# EAGLE schematic full computer (EAGLE 9.6.2)
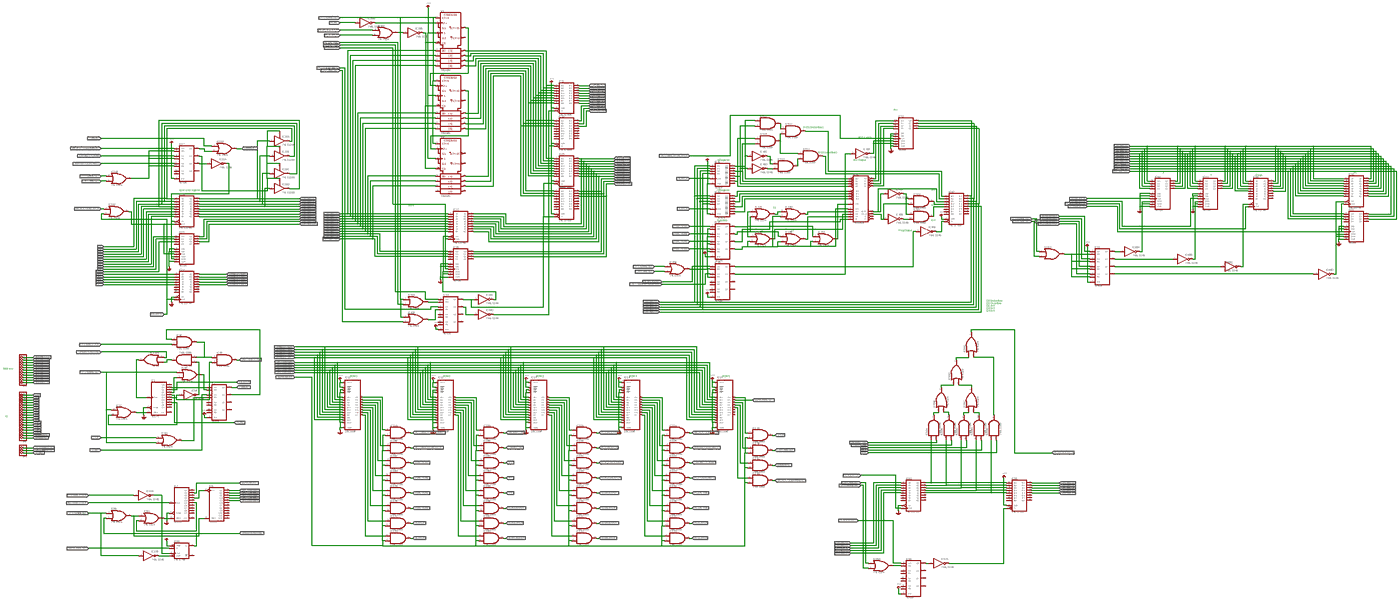
[diagram p0: schematic, sheet 1, overview]
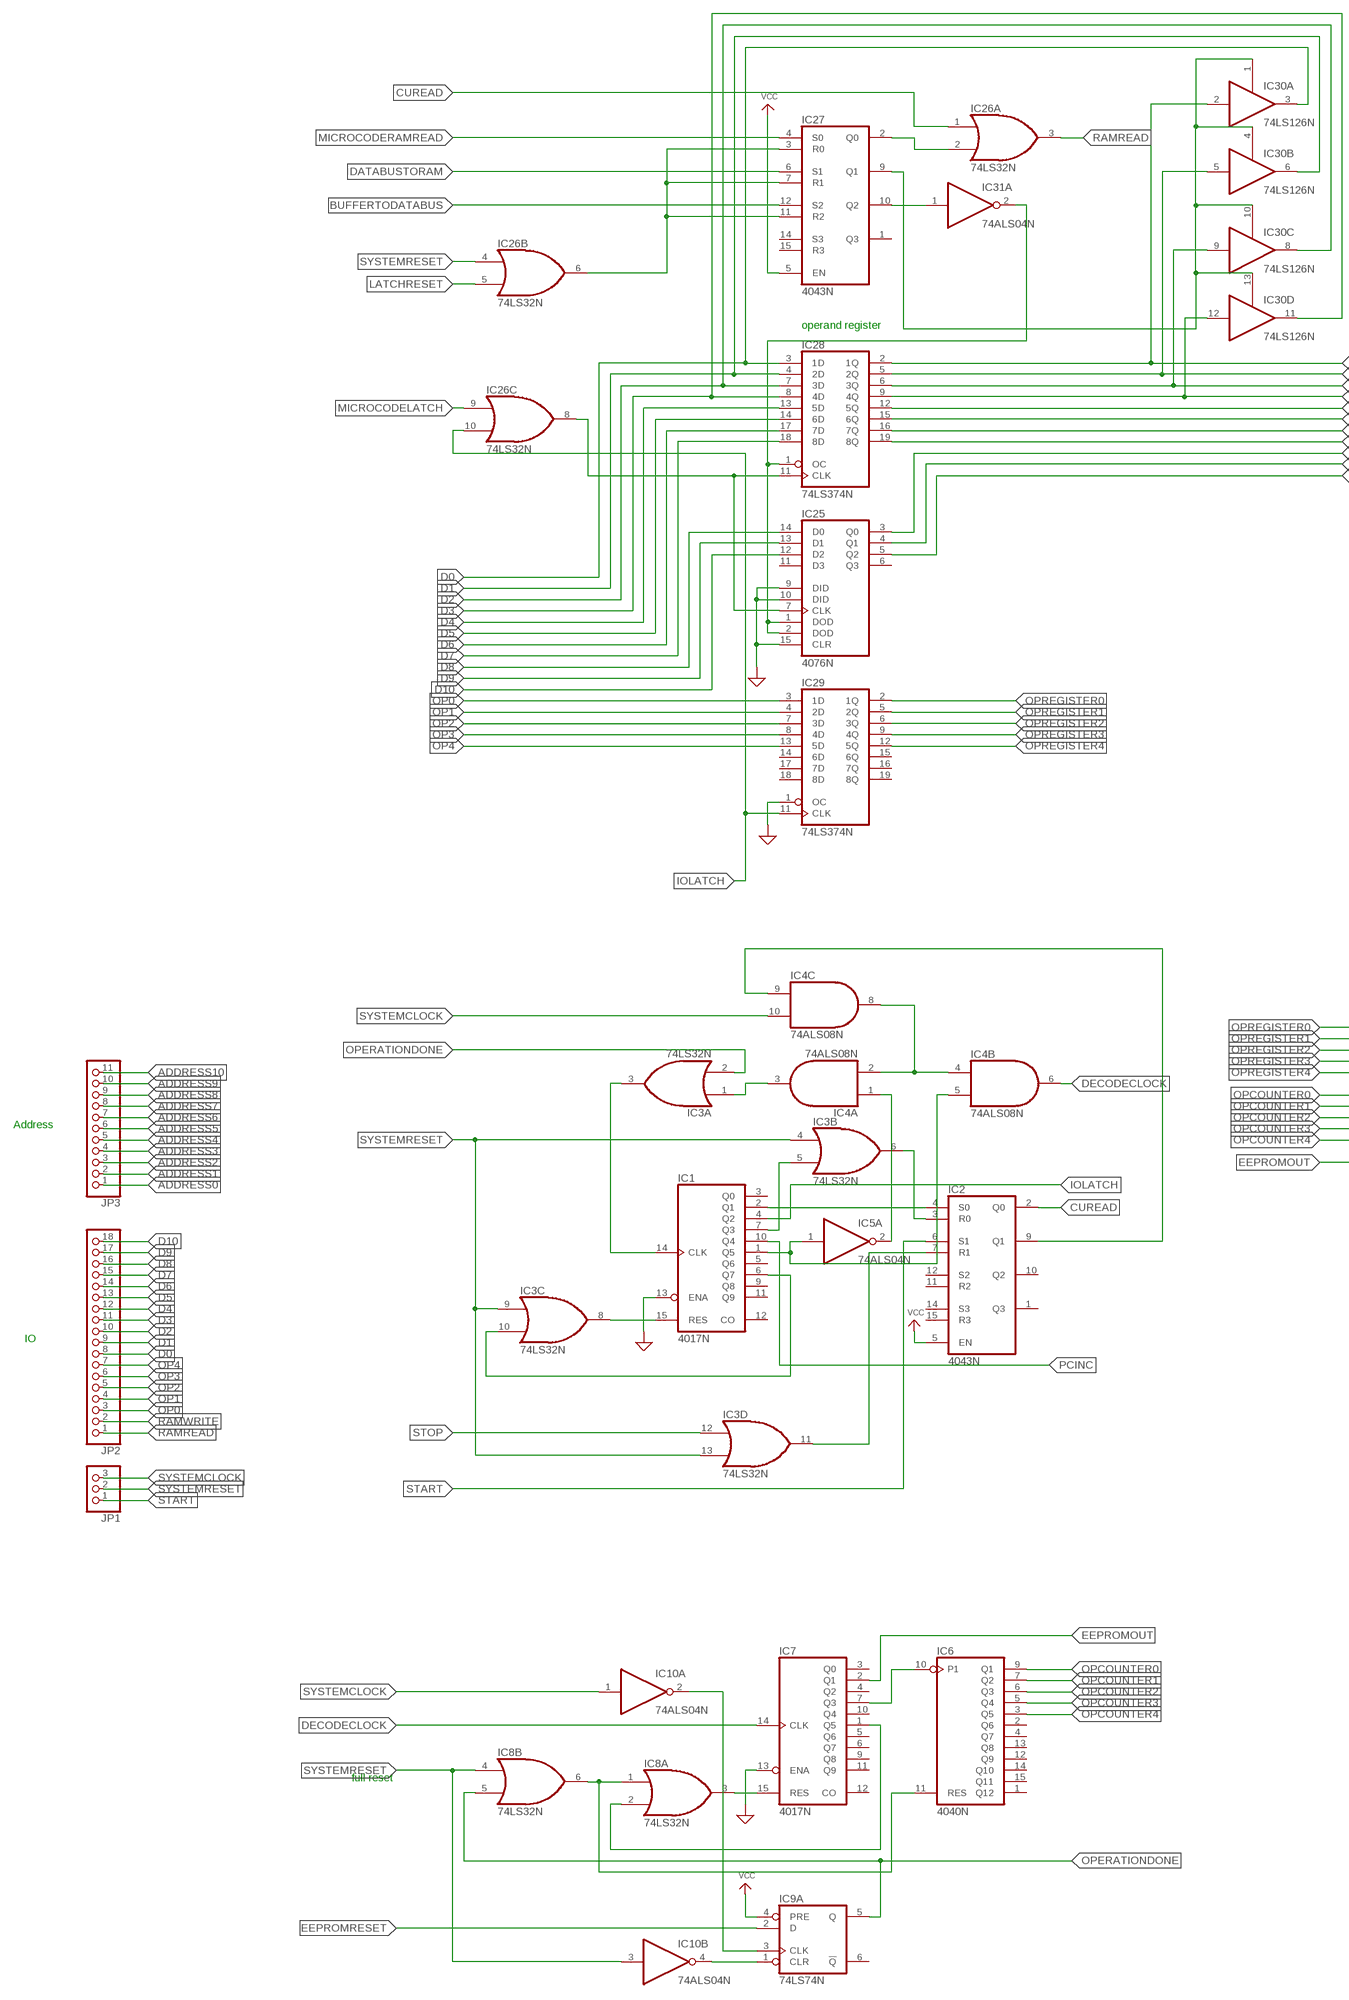
[diagram p1: schematic, sheet 1, part 1 of 6]
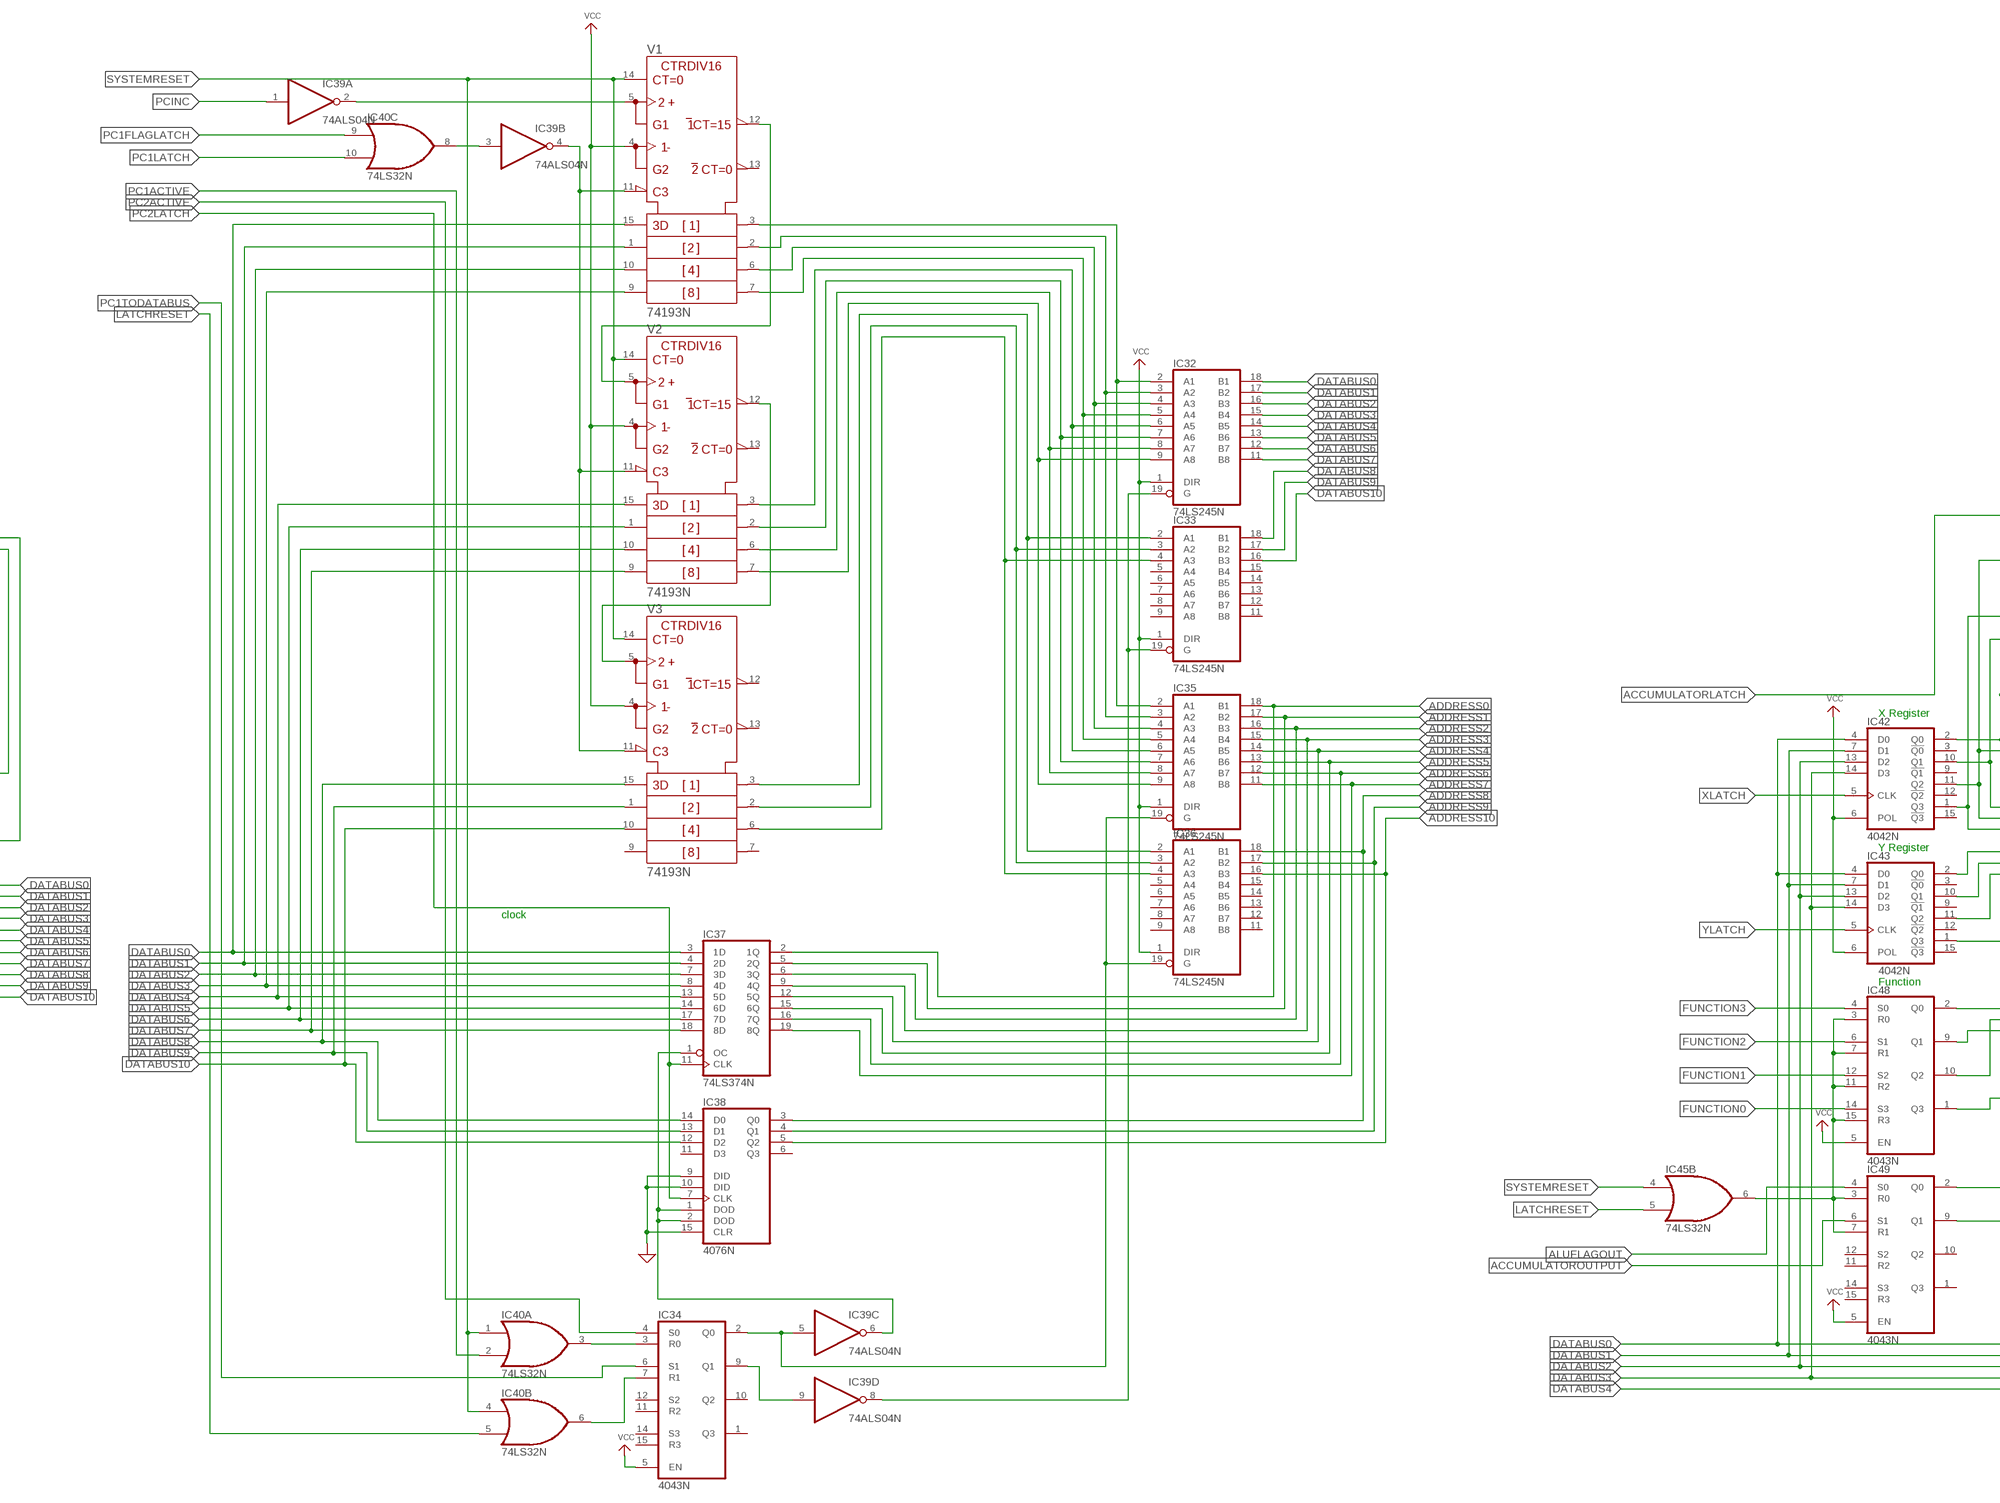
[diagram p2: schematic, sheet 1, part 2 of 6]
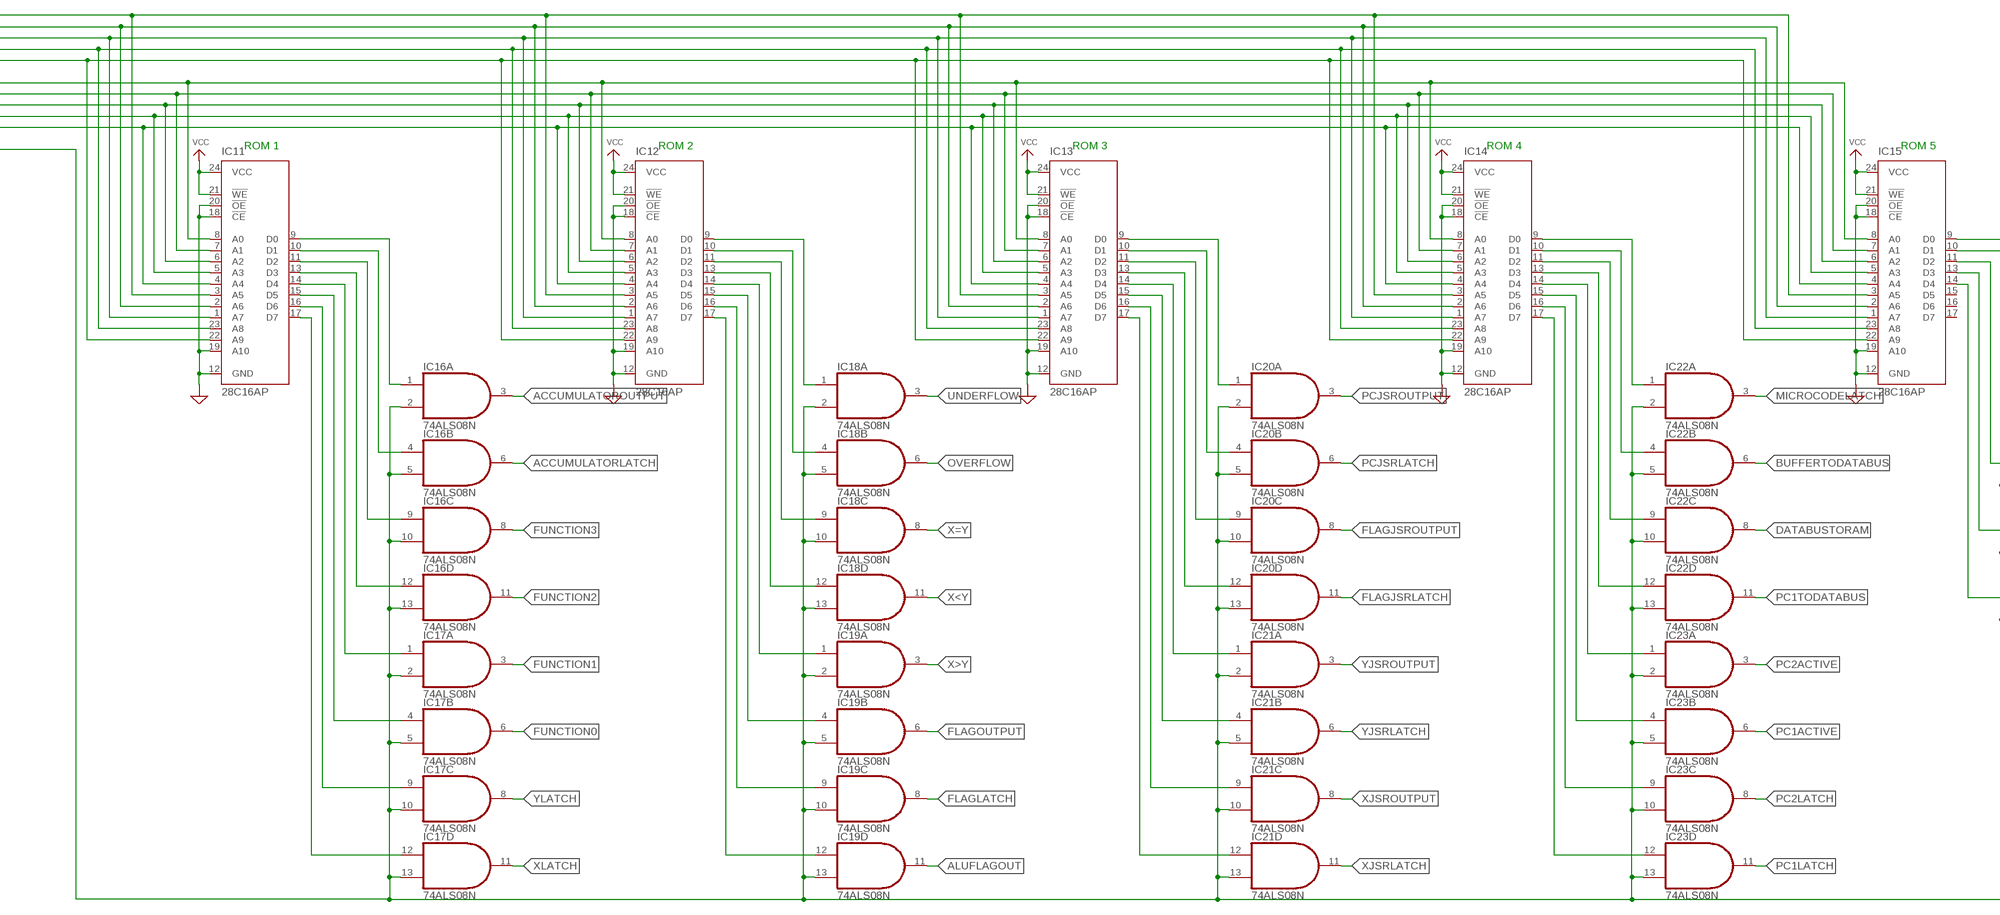
[diagram p3: schematic, sheet 1, part 3 of 6]
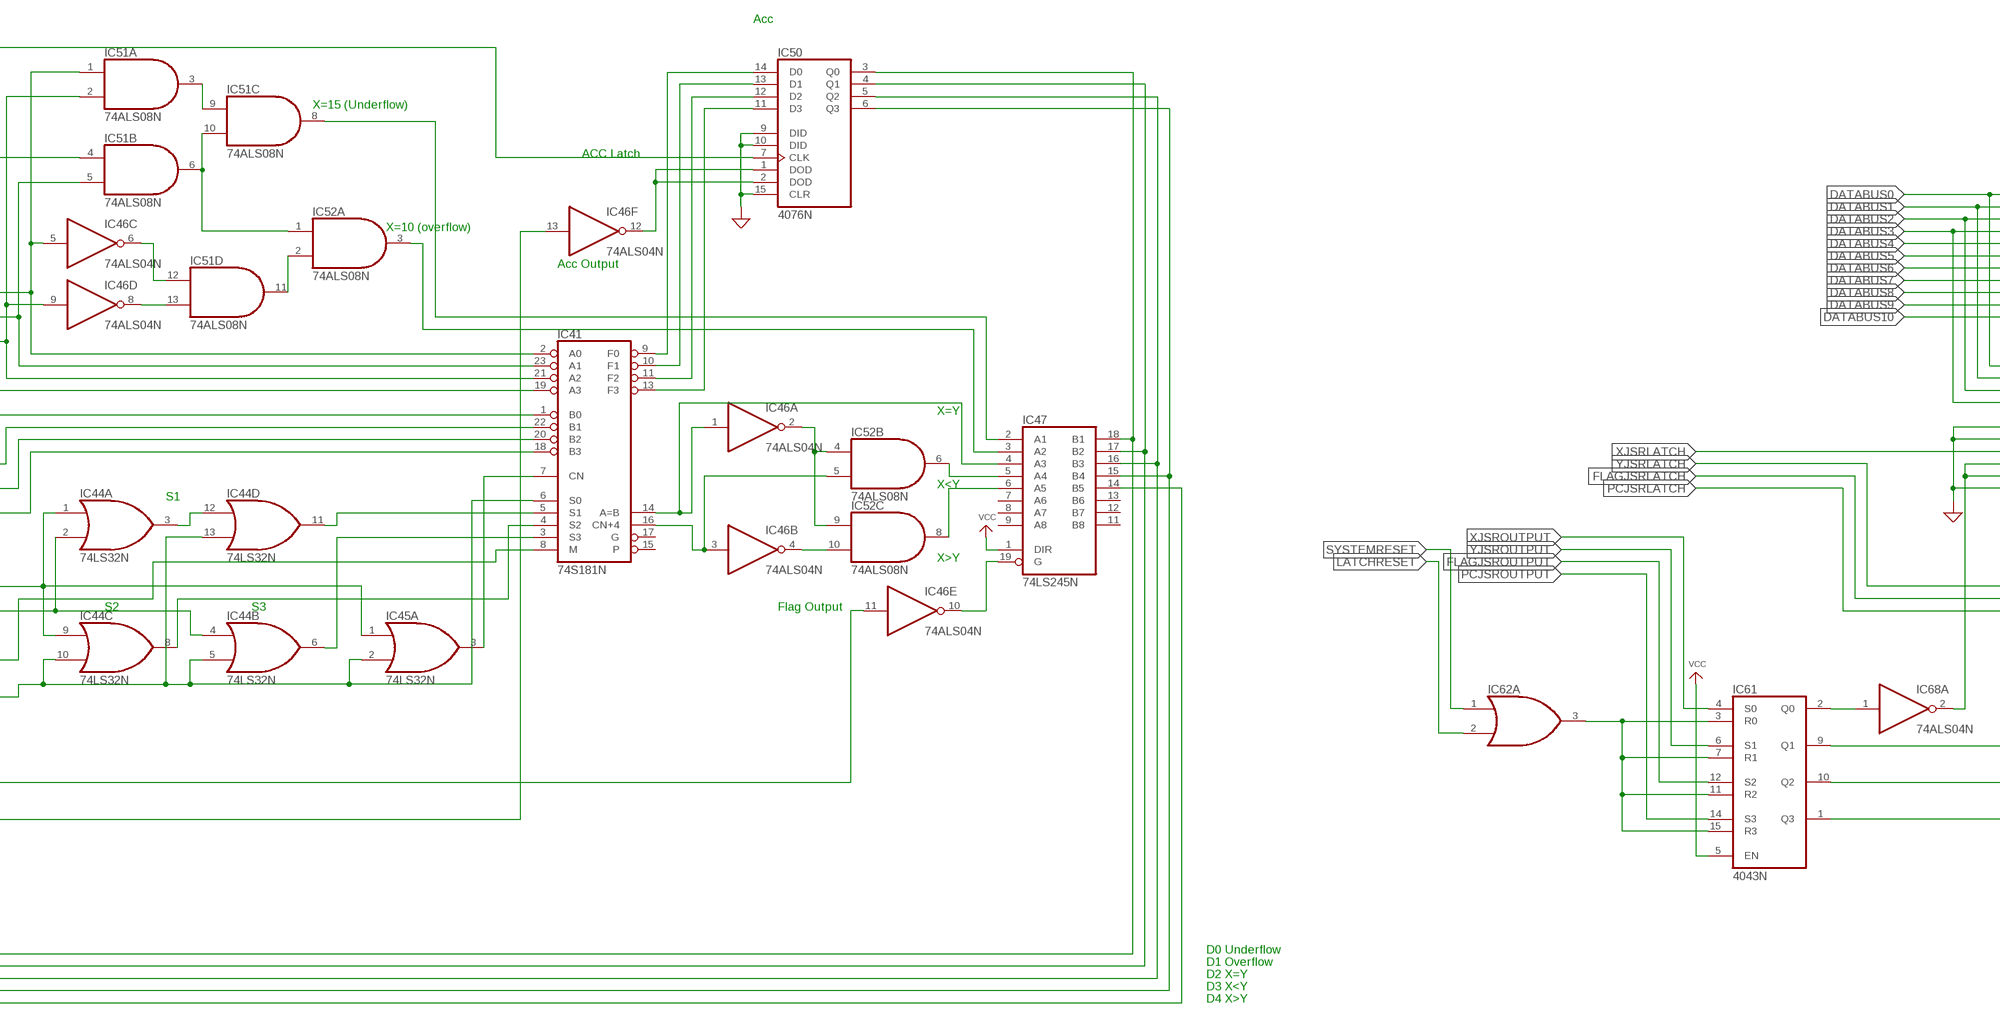
[diagram p4: schematic, sheet 1, part 4 of 6]
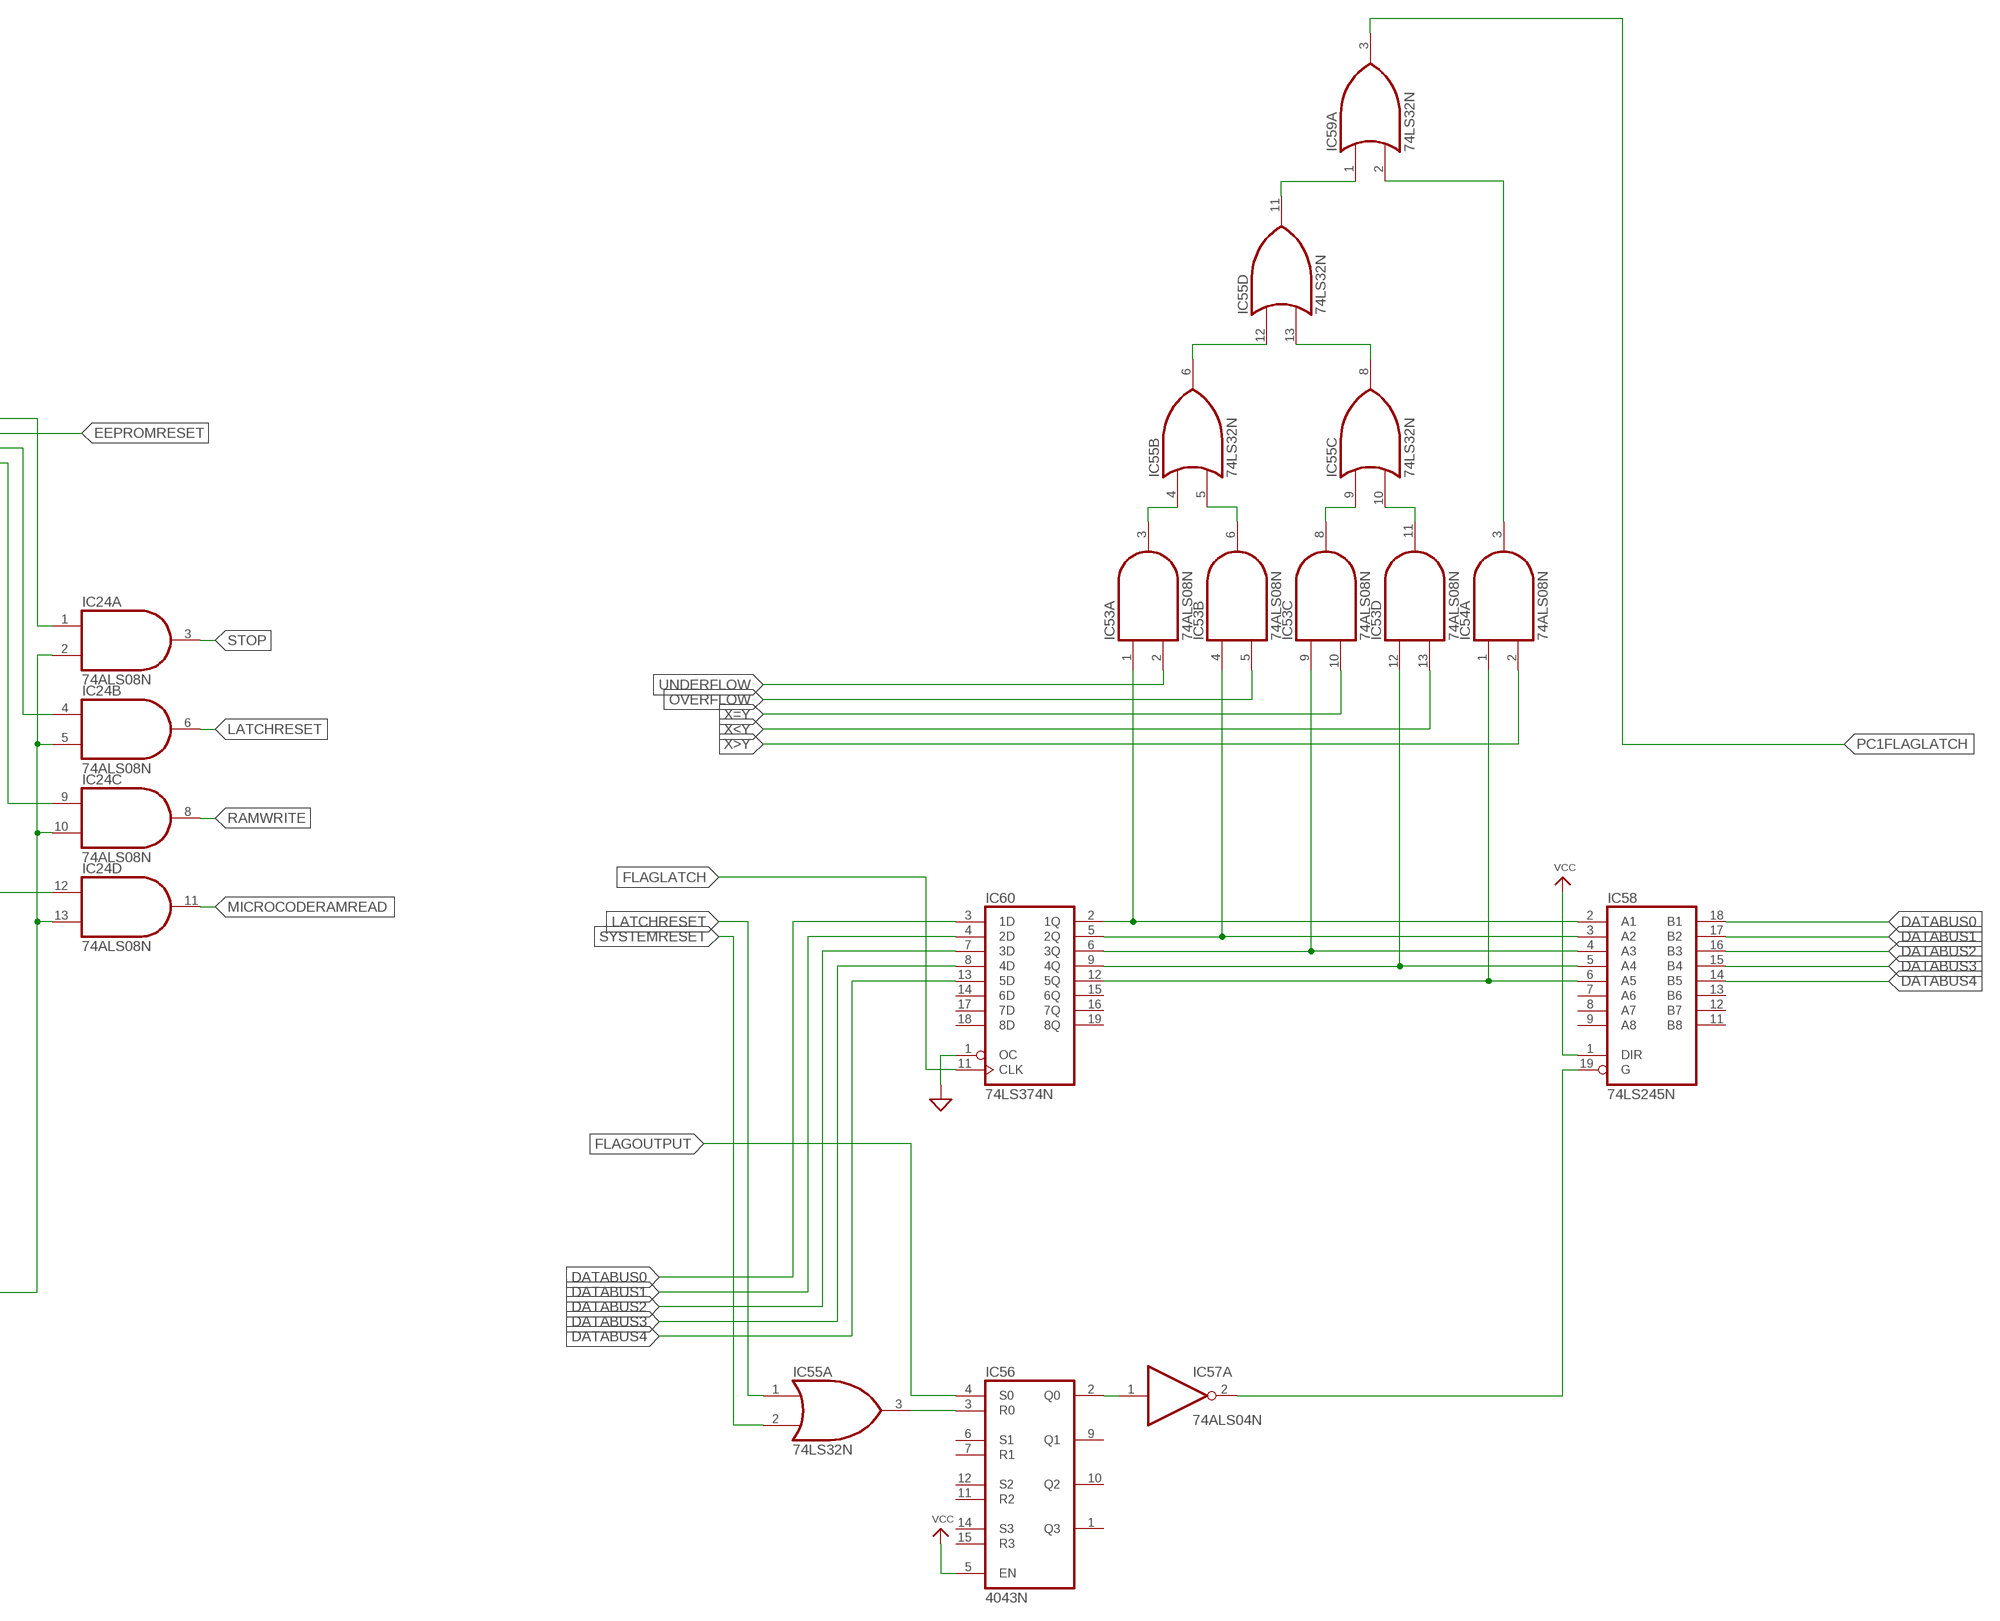
[diagram p5: schematic, sheet 1, part 5 of 6]
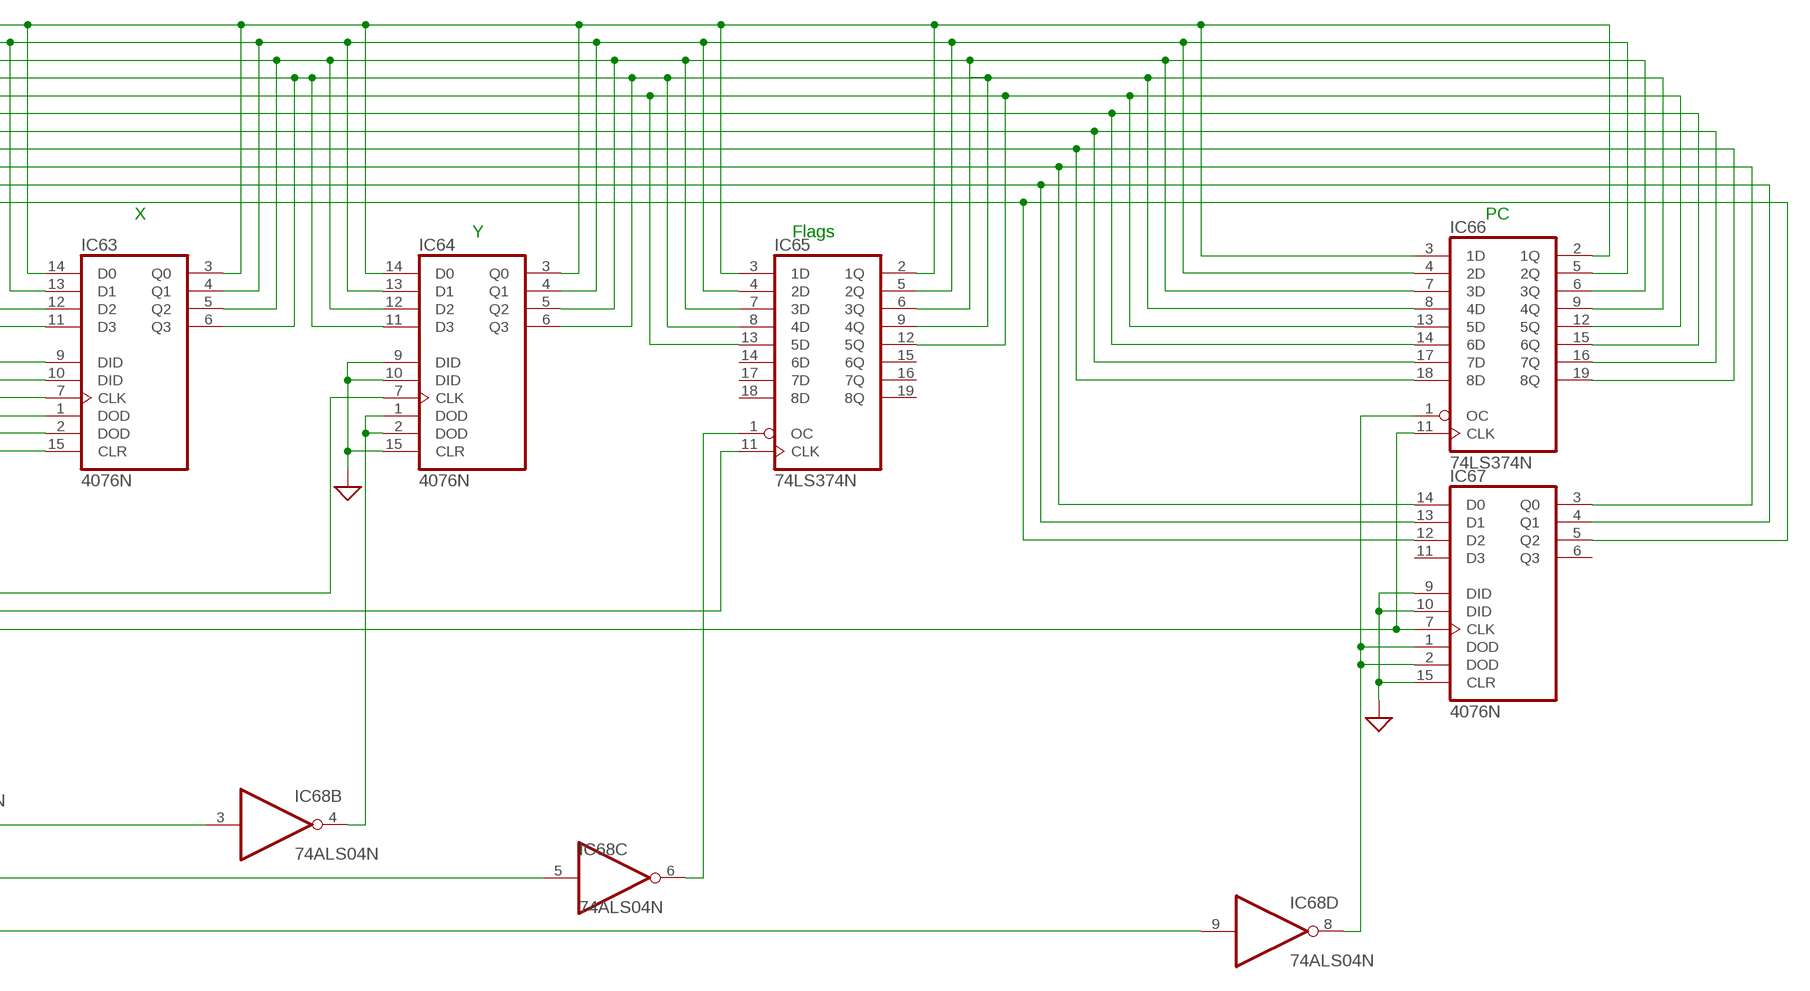
[diagram p6: schematic, sheet 1, part 6 of 6]

## Parts
IC1  4017N  [DIL16]
IC2  4043N  [DIL16]
IC3  74LS32N  [DIL14]
IC4  74ALS08N  [DIL14]
IC5  74ALS04N  [DIL14]
IC6  4040N  [DIL16]
IC7  4017N  [DIL16]
IC8  74LS32N  [DIL14]
IC9  74LS74N  [DIL14]
IC10  74ALS04N  [DIL14]
IC11  28C16AP  [DIL24-6]
IC12  28C16AP  [DIL24-6]
IC13  28C16AP  [DIL24-6]
IC14  28C16AP  [DIL24-6]
IC15  28C16AP  [DIL24-6]
IC16  74ALS08N  [DIL14]
IC17  74ALS08N  [DIL14]
IC18  74ALS08N  [DIL14]
IC19  74ALS08N  [DIL14]
IC20  74ALS08N  [DIL14]
IC21  74ALS08N  [DIL14]
IC22  74ALS08N  [DIL14]
IC23  74ALS08N  [DIL14]
IC24  74ALS08N  [DIL14]
IC25  4076N  [DIL16]
IC26  74LS32N  [DIL14]
IC27  4043N  [DIL16]
IC28  74LS374N  [DIL20]
IC29  74LS374N  [DIL20]
IC30  74LS126N  [DIL14]
IC31  74ALS04N  [DIL14]
IC32  74LS245N  [DIL20]
IC33  74LS245N  [DIL20]
IC34  4043N  [DIL16]
IC35  74LS245N  [DIL20]
IC36  74LS245N  [DIL20]
IC37  74LS374N  [DIL20]
IC38  4076N  [DIL16]
IC39  74ALS04N  [DIL14]
IC40  74LS32N  [DIL14]
IC41  74S181N  [DIL24-6]
IC42  4042N  [DIL16]
IC43  4042N  [DIL16]
IC44  74LS32N  [DIL14]
IC45  74LS32N  [DIL14]
IC46  74ALS04N  [DIL14]
IC47  74LS245N  [DIL20]
IC48  4043N  [DIL16]
IC49  4043N  [DIL16]
IC50  4076N  [DIL16]
IC51  74ALS08N  [DIL14]
IC52  74ALS08N  [DIL14]
IC53  74ALS08N  [DIL14]
IC54  74ALS08N  [DIL14]
IC55  74LS32N  [DIL14]
IC56  4043N  [DIL16]
IC57  74ALS04N  [DIL14]
IC58  74LS245N  [DIL20]
IC59  74LS32N  [DIL14]
IC60  74LS374N  [DIL20]
IC61  4043N  [DIL16]
IC62  74LS32N  [DIL14]
IC63  4076N  [DIL16]
IC64  4076N  [DIL16]
IC65  74LS374N  [DIL20]
IC66  74LS374N  [DIL20]
IC67  4076N  [DIL16]
IC68  74ALS04N  [DIL14]
JP1  PINHD-1X3  [1X03]
JP2  PINHD-1X18  [1X18]
JP3  PINHD-1X11  [1X11]
V1  74193N  [DIL16]
V2  74193N  [DIL16]
V3  74193N  [DIL16]

## Nets
ACCUMULATORLATCH: IC16.6(B:O) IC50.7(CLK)
ACCUMULATOROUTPUT: IC16.3(A:O) IC49.6(S1)
ADDRESS0: IC35.18(B1) IC37.2(1Q) JP3.1
ADDRESS1: IC35.17(B2) IC37.5(2Q) JP3.2
ADDRESS2: IC35.16(B3) IC37.6(3Q) JP3.3
ADDRESS3: IC35.15(B4) IC37.9(4Q) JP3.4
ADDRESS4: IC35.14(B5) IC37.12(5Q) JP3.5
ADDRESS5: IC35.13(B6) IC37.15(6Q) JP3.6
ADDRESS6: IC35.12(B7) IC37.16(7Q) JP3.7
ADDRESS7: IC35.11(B8) IC37.19(8Q) JP3.8
ADDRESS8: IC36.18(B1) IC38.3(Q0) JP3.9
ADDRESS9: IC36.17(B2) IC38.4(Q1) JP3.10
ADDRESS10: IC36.16(B3) IC38.5(Q2) JP3.11
ALUFLAGOUT: IC19.11(D:O) IC49.4(S0)
BUFFERTODATABUS: IC22.6(B:O) IC27.12(S2)
CUREAD: IC2.2(Q0) IC26.1(A:I0)
D0: IC28.3(1D) IC30.3(A:O) JP2.8
D1: IC28.4(2D) IC30.6(B:O) JP2.9
D2: IC28.7(3D) IC30.8(C:O) JP2.10
D3: IC28.8(4D) IC30.11(D:O) JP2.11
D4: IC28.13(5D) JP2.12
D5: IC28.14(6D) JP2.13
D6: IC28.17(7D) JP2.14
D7: IC28.18(8D) JP2.15
D8: IC25.14(D0) JP2.16
D9: IC25.13(D1) JP2.17
D10: IC25.12(D2) JP2.18
DATABUS0: IC28.2(1Q) IC30.2(A:I) IC32.18(B1) IC37.3(1D) IC42.4(D0) IC43.4(D0) IC47.18(B1) IC50.3(Q0) IC58.18(B1) IC60.3(1D) IC63.3(Q0) IC63.14(D0) IC64.3(Q0) IC64.14(D0) IC65.2(1Q) IC65.3(1D) IC66.2(1Q) IC66.3(1D) V1.15(A)
DATABUS1: IC28.5(2Q) IC30.5(B:I) IC32.17(B2) IC37.4(2D) IC42.7(D1) IC43.7(D1) IC47.17(B2) IC50.4(Q1) IC58.17(B2) IC60.4(2D) IC63.4(Q1) IC63.13(D1) IC64.4(Q1) IC64.13(D1) IC65.4(2D) IC65.5(2Q) IC66.4(2D) IC66.5(2Q) V1.1(B)
DATABUS2: IC28.6(3Q) IC30.9(C:I) IC32.16(B3) IC37.7(3D) IC42.13(D2) IC43.13(D2) IC47.16(B3) IC50.5(Q2) IC58.16(B3) IC60.7(3D) IC63.5(Q2) IC63.12(D2) IC64.5(Q2) IC64.12(D2) IC65.6(3Q) IC65.7(3D) IC66.6(3Q) IC66.7(3D) V1.10(C)
DATABUS3: IC28.9(4Q) IC30.12(D:I) IC32.15(B4) IC37.8(4D) IC42.14(D3) IC43.14(D3) IC47.15(B4) IC50.6(Q3) IC58.15(B4) IC60.8(4D) IC63.6(Q3) IC63.11(D3) IC64.6(Q3) IC64.11(D3) IC65.8(4D) IC65.9(4Q) IC66.8(4D) IC66.9(4Q) V1.9(D)
DATABUS4: IC28.12(5Q) IC32.14(B5) IC37.13(5D) IC47.14(B5) IC58.14(B5) IC60.13(5D) IC65.12(5Q) IC65.13(5D) IC66.12(5Q) IC66.13(5D) V2.15(A)
DATABUS5: IC28.15(6Q) IC32.13(B6) IC37.14(6D) IC66.14(6D) IC66.15(6Q) V2.1(B)
DATABUS6: IC28.16(7Q) IC32.12(B7) IC37.17(7D) IC66.16(7Q) IC66.17(7D) V2.10(C)
DATABUS7: IC28.19(8Q) IC32.11(B8) IC37.18(8D) IC66.18(8D) IC66.19(8Q) V2.9(D)
DATABUS8: IC25.3(Q0) IC33.18(B1) IC38.14(D0) IC67.3(Q0) IC67.14(D0) V3.15(A)
DATABUS9: IC25.4(Q1) IC33.17(B2) IC38.13(D1) IC67.4(Q1) IC67.13(D1) V3.1(B)
DATABUS10: IC25.5(Q2) IC33.16(B3) IC38.12(D2) IC67.5(Q2) IC67.12(D2) V3.10(C)
DATABUSTORAM: IC22.8(C:O) IC27.6(S1)
DECODECLOCK: IC4.6(B:O) IC7.14(CLK)
EEPROMOUT: IC7.2(Q1) IC16.2(A:I1) IC16.5(B:I1) IC16.10(C:I1) IC16.13(D:I1) IC17.2(A:I1) IC17.5(B:I1) IC17.10(C:I1) IC17.13(D:I1) IC18.2(A:I1) IC18.5(B:I1) IC18.10(C:I1) IC18.13(D:I1) IC19.2(A:I1) IC19.5(B:I1) IC19.10(C:I1) IC19.13(D:I1) IC20.2(A:I1) IC20.5(B:I1) IC20.10(C:I1) IC20.13(D:I1) IC21.2(A:I1) IC21.5(B:I1) IC21.10(C:I1) IC21.13(D:I1) IC22.2(A:I1) IC22.5(B:I1) IC22.10(C:I1) IC22.13(D:I1) IC23.2(A:I1) IC23.5(B:I1) IC23.10(C:I1) IC23.13(D:I1) IC24.2(A:I1) IC24.5(B:I1) IC24.10(C:I1) IC24.13(D:I1)
EEPROMRESET: IC9.2(A:D) IC15.10(D1)
FLAGJSRLATCH: IC20.11(D:O) IC65.11(CLK)
FLAGJSROUTPUT: IC20.8(C:O) IC61.12(S2)
FLAGLATCH: IC19.8(C:O) IC60.11(CLK)
FLAGOUTPUT: IC19.6(B:O) IC56.4(S0)
FUNCTION0: IC17.6(B:O) IC48.14(S3)
FUNCTION1: IC17.3(A:O) IC48.12(S2)
FUNCTION2: IC16.11(D:O) IC48.6(S1)
FUNCTION3: IC16.8(C:O) IC48.4(S0)
GND: IC1.13(ENA) IC7.13(ENA) IC11.12(GND) IC11.18(!CE) IC11.19(A10) IC11.20(!OE) IC12.12(GND) IC12.18(!CE) IC12.19(A10) IC12.20(!OE) IC13.12(GND) IC13.18(!CE) IC13.19(A10) IC13.20(!OE) IC14.12(GND) IC14.18(!CE) IC14.19(A10) IC14.20(!OE) IC15.12(GND) IC15.18(!CE) IC15.19(A10) IC15.20(!OE) IC25.9(DID) IC25.10(DID) IC25.15(CLR) IC29.1(OC) IC38.9(DID) IC38.10(DID) IC38.15(CLR) IC50.9(DID) IC50.10(DID) IC50.15(CLR) IC60.1(OC) IC63.9(DID) IC63.10(DID) IC63.15(CLR) IC64.9(DID) IC64.10(DID) IC64.15(CLR) IC67.9(DID) IC67.10(DID) IC67.15(CLR) ; supply symbol labelled SUP
IOLATCH: IC1.4(Q2) IC26.10(C:I1) IC29.11(CLK)
LATCHRESET: IC24.6(B:O) IC26.5(B:I1) IC40.5(B:I1) IC45.5(B:I1) IC55.1(A:I0) IC62.2(A:I1)
MICROCODELATCH: IC22.3(A:O) IC26.9(C:I0)
MICROCODERAMREAD: IC24.11(D:O) IC27.4(S0)
N$1: V1.12(!CO) V2.5(UP)
N$2: IC1.2(Q1) IC2.4(S0)
N$3: IC2.3(R0) IC3.6(B:O)
N$4: V2.12(!CO) V3.5(UP)
N$5: IC1.7(Q3) IC3.5(B:I1)
N$6: IC1.1(Q5) IC4.5(B:I1) IC5.1(A:I)
N$7: IC4.1(A:I0) IC5.2(A:O)
N$8: IC3.1(A:I0) IC4.3(A:O)
N$9: IC1.14(CLK) IC3.3(A:O)
N$10: IC39.4(B:O) V1.11(!LOAD) V2.11(!LOAD) V3.11(!LOAD)
N$11: IC39.3(B:I) IC40.8(C:O)
N$12: IC41.2(A0) IC42.2(Q0) IC46.5(C:I) IC51.1(A:I0)
N$13: IC41.23(A1) IC42.10(Q1) IC51.5(B:I1)
N$14: IC1.15(RES) IC3.8(C:O)
N$15: IC34.3(R0) IC40.3(A:O)
N$16: IC41.19(A3) IC42.1(Q3) IC51.4(B:I0)
N$17: IC1.6(Q7) IC3.10(C:I1)
N$18: IC6.10(P1) IC7.7(Q3)
N$19: IC2.7(R1) IC3.11(D:O)
N$20: IC34.2(Q0) IC35.19(G) IC36.19(G) IC39.5(C:I)
N$21: IC4.2(A:I1) IC4.4(B:I0) IC4.8(C:O)
N$22: IC41.22(B1) IC43.10(Q1)
N$23: IC2.9(Q1) IC4.9(C:I0)
N$24: IC41.20(B2) IC43.11(Q2)
N$25: IC41.18(B3) IC43.1(Q3)
N$26: IC41.1(B0) IC43.2(Q0)
N$29: IC7.1(Q5) IC8.2(A:I1)
N$30: IC7.15(RES) IC8.3(A:O)
N$32: IC6.11(RES) IC8.1(A:I0) IC8.6(B:O)
N$33: IC26.6(B:O) IC27.3(R0) IC27.7(R1) IC27.11(R2)
N$36: IC44.2(A:I1) IC44.4(B:I0) IC48.9(Q1)
N$37: IC26.2(A:I1) IC27.2(Q0)
N$38: IC44.3(A:O) IC44.12(D:I0)
N$39: IC41.5(S1) IC44.11(D:O)
N$40: IC9.3(A:CLK) IC10.2(A:O)
N$41: IC44.1(A:I0) IC44.9(C:I0) IC45.1(A:I0) IC48.2(Q0)
N$42: IC27.9(Q1) IC30.1(A:OE) IC30.4(B:OE) IC30.10(C:OE) IC30.13(D:OE)
N$43: IC9.1(A:CLR) IC10.4(B:O)
N$44: IC11.9(D0) IC16.1(A:I0)
N$45: IC11.10(D1) IC16.4(B:I0)
N$46: IC11.11(D2) IC16.9(C:I0)
N$47: IC11.13(D3) IC16.12(D:I0)
N$48: IC11.14(D4) IC17.1(A:I0)
N$49: IC11.15(D5) IC17.4(B:I0)
N$50: IC11.16(D6) IC17.9(C:I0)
N$51: IC11.17(D7) IC17.12(D:I0)
N$52: IC32.2(A1) IC35.2(A1) V1.3(QA)
N$53: IC12.9(D0) IC18.1(A:I0)
N$54: IC12.10(D1) IC18.4(B:I0)
N$55: IC12.11(D2) IC18.9(C:I0)
N$56: IC12.13(D3) IC18.12(D:I0)
N$57: IC12.14(D4) IC19.1(A:I0)
N$58: IC12.15(D5) IC19.4(B:I0)
N$59: IC12.16(D6) IC19.9(C:I0)
N$60: IC12.17(D7) IC19.12(D:I0)
N$61: IC13.9(D0) IC20.1(A:I0)
N$62: IC13.10(D1) IC20.4(B:I0)
N$63: IC13.11(D2) IC20.9(C:I0)
N$64: IC13.13(D3) IC20.12(D:I0)
N$65: IC13.14(D4) IC21.1(A:I0)
N$66: IC13.15(D5) IC21.4(B:I0)
N$67: IC13.16(D6) IC21.9(C:I0)
N$68: IC13.17(D7) IC21.12(D:I0)
N$69: IC14.9(D0) IC22.1(A:I0)
N$70: IC14.10(D1) IC22.4(B:I0)
N$71: IC14.11(D2) IC22.9(C:I0)
N$72: IC14.13(D3) IC22.12(D:I0)
N$73: IC14.14(D4) IC23.1(A:I0)
N$74: IC14.15(D5) IC23.4(B:I0)
N$75: IC14.16(D6) IC23.9(C:I0)
N$76: IC14.17(D7) IC23.12(D:I0)
N$77: IC15.9(D0) IC24.1(A:I0)
N$78: IC15.11(D2) IC24.4(B:I0)
N$79: IC15.13(D3) IC24.9(C:I0)
N$80: IC15.14(D4) IC24.12(D:I0)
N$81: IC32.3(A2) IC35.3(A2) V1.2(QB)
N$82: IC32.5(A4) IC35.5(A4) V1.7(QD)
N$83: IC27.10(Q2) IC31.1(A:I)
N$84: IC32.6(A5) IC35.6(A5) V2.3(QA)
N$85: IC32.7(A6) IC35.7(A6) V2.2(QB)
N$86: IC32.8(A7) IC35.8(A7) V2.6(QC)
N$87: IC33.2(A1) IC36.2(A1) V3.3(QA)
N$88: IC33.3(A2) IC36.3(A2) V3.2(QB)
N$89: IC33.4(A3) IC36.4(A3) V3.6(QC)
N$90: IC41.3(S3) IC44.6(B:O)
N$91: IC41.6(S0) IC44.5(B:I1) IC44.10(C:I1) IC44.13(D:I1) IC45.2(A:I1) IC48.1(Q3)
N$92: IC34.7(R1) IC40.6(B:O)
N$93: IC41.4(S2) IC44.8(C:O)
N$94: IC34.9(Q1) IC39.9(D:I)
N$95: IC32.19(G) IC33.19(G) IC39.8(D:O)
N$96: IC32.4(A3) IC35.4(A3) V1.6(QC)
N$97: IC41.8(M) IC48.10(Q2)
N$98: IC41.7(CN) IC45.3(A:O)
N$99: IC41.9(F0) IC50.14(D0)
N$100: IC41.10(F1) IC50.13(D1)
N$101: IC25.7(CLK) IC26.8(C:O) IC28.11(CLK)
N$102: IC25.1(DOD) IC25.2(DOD) IC28.1(OC) IC31.2(A:O)
N$103: IC41.11(F2) IC50.12(D2)
N$104: IC41.13(F3) IC50.11(D3)
N$105: IC53.1(A:I0) IC58.2(A1) IC60.2(1Q)
N$106: IC41.16(CN+4) IC46.3(B:I) IC52.5(B:I1)
N$107: IC46.4(B:O) IC52.10(C:I1)
N$108: IC41.14(A=B) IC46.1(A:I) IC47.4(A3)
N$109: IC46.2(A:O) IC52.4(B:I0) IC52.9(C:I0)
N$110: IC51.3(A:O) IC51.9(C:I0)
N$111: IC51.6(B:O) IC51.10(C:I1) IC52.1(A:I0)
N$112: IC41.21(A2) IC42.11(Q2) IC46.9(D:I) IC51.2(A:I1)
N$113: IC46.8(D:O) IC51.13(D:I1)
N$114: IC46.6(C:O) IC51.12(D:I0)
N$115: IC51.11(D:O) IC52.2(A:I1)
N$116: IC47.3(A2) IC52.3(A:O)
N$117: IC47.2(A1) IC51.8(C:O)
N$118: IC47.5(A4) IC52.6(B:O)
N$119: IC47.6(A5) IC52.8(C:O)
N$120: IC32.9(A8) IC35.9(A8) V2.7(QD)
N$121: IC37.1(OC) IC38.1(DOD) IC38.2(DOD) IC39.6(C:O)
N$122: IC46.10(E:O) IC47.19(G)
N$123: IC39.2(A:O) V1.5(UP)
N$124: IC46.11(E:I) IC49.2(Q0)
N$125: IC46.13(F:I) IC49.9(Q1)
N$126: IC53.4(B:I0) IC58.3(A2) IC60.5(2Q)
N$127: IC53.9(C:I0) IC58.4(A3) IC60.6(3Q)
N$128: IC53.12(D:I0) IC58.5(A4) IC60.9(4Q)
N$129: IC54.1(A:I0) IC58.6(A5) IC60.12(5Q)
N$130: IC45.6(B:O) IC48.3(R0) IC48.7(R1) IC48.11(R2) IC48.15(R3) IC49.3(R0) IC49.7(R1)
N$133: IC46.12(F:O) IC50.1(DOD) IC50.2(DOD)
N$137: IC55.3(A:O) IC56.3(R0)
N$140: IC61.1(Q3) IC68.9(D:I)
N$141: IC56.2(Q0) IC57.1(A:I)
N$142: IC57.2(A:O) IC58.19(G)
N$145: IC61.3(R0) IC61.7(R1) IC61.11(R2) IC61.15(R3) IC62.3(A:O)
N$147: IC61.2(Q0) IC68.1(A:I)
N$148: IC53.3(A:O) IC55.4(B:I0)
N$149: IC53.6(B:O) IC55.5(B:I1)
N$150: IC53.8(C:O) IC55.9(C:I0)
N$151: IC53.11(D:O) IC55.10(C:I1)
N$152: IC55.6(B:O) IC55.12(D:I0)
N$153: IC55.8(C:O) IC55.13(D:I1)
N$154: IC55.11(D:O) IC59.1(A:I0)
N$155: IC54.3(A:O) IC59.2(A:I1)
N$157: IC61.9(Q1) IC68.3(B:I)
N$159: IC61.10(Q2) IC68.5(C:I)
N$162: IC63.1(DOD) IC63.2(DOD) IC68.2(A:O)
N$163: IC64.1(DOD) IC64.2(DOD) IC68.4(B:O)
N$164: IC65.1(OC) IC68.6(C:O)
N$166: IC66.1(OC) IC67.1(DOD) IC67.2(DOD) IC68.8(D:O)
OP0: IC29.3(1D) JP2.3
OP1: IC29.4(2D) JP2.4
OP2: IC29.7(3D) JP2.5
OP3: IC29.8(4D) JP2.6
OP4: IC29.13(5D) JP2.7
OPCOUNTER0: IC6.9(Q1) IC11.8(A0) IC12.8(A0) IC13.8(A0) IC14.8(A0) IC15.8(A0)
OPCOUNTER1: IC6.7(Q2) IC11.7(A1) IC12.7(A1) IC13.7(A1) IC14.7(A1) IC15.7(A1)
OPCOUNTER2: IC6.6(Q3) IC11.6(A2) IC12.6(A2) IC13.6(A2) IC14.6(A2) IC15.6(A2)
OPCOUNTER3: IC6.5(Q4) IC11.5(A3) IC12.5(A3) IC13.5(A3) IC14.5(A3) IC15.5(A3)
OPCOUNTER4: IC6.3(Q5) IC11.4(A4) IC12.4(A4) IC13.4(A4) IC14.4(A4) IC15.4(A4)
OPERATIONDONE: IC3.2(A:I1) IC8.5(B:I1) IC9.5(A:Q)
OPREGISTER0: IC11.3(A5) IC12.3(A5) IC13.3(A5) IC14.3(A5) IC15.3(A5) IC29.2(1Q)
OPREGISTER1: IC11.2(A6) IC12.2(A6) IC13.2(A6) IC14.2(A6) IC15.2(A6) IC29.5(2Q)
OPREGISTER2: IC11.1(A7) IC12.1(A7) IC13.1(A7) IC14.1(A7) IC15.1(A7) IC29.6(3Q)
OPREGISTER3: IC11.23(A8) IC12.23(A8) IC13.23(A8) IC14.23(A8) IC15.23(A8) IC29.9(4Q)
OPREGISTER4: IC11.22(A9) IC12.22(A9) IC13.22(A9) IC14.22(A9) IC15.22(A9) IC29.12(5Q)
OVERFLOW: IC18.6(B:O) IC53.5(B:I1)
PC1ACTIVE: IC23.6(B:O) IC40.2(A:I1)
PC1FLAGLATCH: IC40.9(C:I0) IC59.3(A:O)
PC1LATCH: IC23.11(D:O) IC40.10(C:I1)
PC1TODATABUS: IC22.11(D:O) IC34.6(S1)
PC2ACTIVE: IC23.3(A:O) IC34.4(S0)
PC2LATCH: IC23.8(C:O) IC37.11(CLK) IC38.7(CLK)
PCINC: IC1.10(Q4) IC39.1(A:I)
PCJSRLATCH: IC20.6(B:O) IC66.11(CLK) IC67.7(CLK)
PCJSROUTPUT: IC20.3(A:O) IC61.14(S3)
RAMREAD: IC26.3(A:O) JP2.1
RAMWRITE: IC24.8(C:O) JP2.2
START: IC2.6(S1) JP1.1
STOP: IC3.12(D:I0) IC24.3(A:O)
SYSTEMCLOCK: IC4.10(C:I1) IC10.1(A:I) JP1.3
SYSTEMRESET: IC3.4(B:I0) IC3.9(C:I0) IC3.13(D:I1) IC8.4(B:I0) IC10.3(B:I) IC26.4(B:I0) IC40.1(A:I0) IC40.4(B:I0) IC45.4(B:I0) IC55.2(A:I1) IC62.1(A:I0) JP1.2 V1.14(CLR) V2.14(CLR) V3.14(CLR)
UNDERFLOW: IC18.3(A:O) IC53.2(A:I1)
VCC: IC2.5(EN) IC9.4(A:PRE) IC11.21(!WE) IC11.24(VCC) IC12.21(!WE) IC12.24(VCC) IC13.21(!WE) IC13.24(VCC) IC14.21(!WE) IC14.24(VCC) IC15.21(!WE) IC15.24(VCC) IC27.5(EN) IC32.1(DIR) IC33.1(DIR) IC34.5(EN) IC35.1(DIR) IC36.1(DIR) IC42.6(POL) IC43.6(POL) IC47.1(DIR) IC48.5(EN) IC49.5(EN) IC56.5(EN) IC58.1(DIR) IC61.5(EN) V1.4(DOWN) V2.4(DOWN) V3.4(DOWN)
X<Y: IC18.11(D:O) IC53.13(D:I1)
X=Y: IC18.8(C:O) IC53.10(C:I1)
X>Y: IC19.3(A:O) IC54.2(A:I1)
XJSRLATCH: IC21.11(D:O) IC63.7(CLK)
XJSROUTPUT: IC21.8(C:O) IC61.4(S0)
XLATCH: IC17.11(D:O) IC42.5(CLK)
YJSRLATCH: IC21.6(B:O) IC64.7(CLK)
YJSROUTPUT: IC21.3(A:O) IC61.6(S1)
YLATCH: IC17.8(C:O) IC43.5(CLK)
Unconnected: IC1.3(Q0) IC1.5(Q6) IC1.9(Q8) IC1.11(Q9) IC1.12(CO) IC2.1(Q3) IC2.10(Q2) IC2.11(R2) IC2.12(S2) IC2.14(S3) IC2.15(R3) IC4.11(D:O) IC4.12(D:I0) IC4.13(D:I1) IC5.3(B:I) IC5.4(B:O) IC5.5(C:I) IC5.6(C:O) IC5.8(D:O) IC5.9(D:I) IC5.10(E:O) IC5.11(E:I) IC5.12(F:O) IC5.13(F:I) IC6.1(Q12) IC6.2(Q6) IC6.4(Q7) IC6.12(Q9) IC6.13(Q8) IC6.14(Q10) IC6.15(Q11) IC7.3(Q0) IC7.4(Q2) IC7.5(Q6) IC7.6(Q7) IC7.9(Q8) IC7.10(Q4) IC7.11(Q9) IC7.12(CO) IC8.8(C:O) IC8.9(C:I0) IC8.10(C:I1) IC8.11(D:O) IC8.12(D:I0) IC8.13(D:I1) IC9.6(A:!Q) IC9.8(B:!Q) IC9.9(B:Q) IC9.10(B:PRE) IC9.11(B:CLK) IC9.12(B:D) IC9.13(B:CLR) IC10.5(C:I) IC10.6(C:O) IC10.8(D:O) IC10.9(D:I) IC10.10(E:O) IC10.11(E:I) IC10.12(F:O) IC10.13(F:I) IC15.15(D5) IC15.16(D6) IC15.17(D7) IC25.6(Q3) IC25.11(D3) IC26.11(D:O) IC26.12(D:I0) IC26.13(D:I1) IC27.1(Q3) IC27.14(S3) IC27.15(R3) IC29.14(6D) IC29.15(6Q) IC29.16(7Q) IC29.17(7D) IC29.18(8D) IC29.19(8Q) IC31.3(B:I) IC31.4(B:O) IC31.5(C:I) IC31.6(C:O) IC31.8(D:O) IC31.9(D:I) IC31.10(E:O) IC31.11(E:I) IC31.12(F:O) IC31.13(F:I) IC33.5(A4) IC33.6(A5) IC33.7(A6) IC33.8(A7) IC33.9(A8) IC33.11(B8) IC33.12(B7) IC33.13(B6) IC33.14(B5) IC33.15(B4) IC34.1(Q3) IC34.10(Q2) IC34.11(R2) IC34.12(S2) IC34.14(S3) IC34.15(R3) IC36.5(A4) IC36.6(A5) IC36.7(A6) IC36.8(A7) IC36.9(A8) IC36.11(B8) IC36.12(B7) IC36.13(B6) IC36.14(B5) IC36.15(B4) IC38.6(Q3) IC38.11(D3) IC39.10(E:O) IC39.11(E:I) IC39.12(F:O) IC39.13(F:I) IC40.11(D:O) IC40.12(D:I0) IC40.13(D:I1) IC41.15(P) IC41.17(G) IC42.3(!Q0) IC42.9(!Q1) IC42.12(!Q2) IC42.15(!Q3) IC43.3(!Q0) IC43.9(!Q1) IC43.12(!Q2) IC43.15(!Q3) IC45.8(C:O) IC45.9(C:I0) IC45.10(C:I1) IC45.11(D:O) IC45.12(D:I0) IC45.13(D:I1) IC47.7(A6) IC47.8(A7) IC47.9(A8) IC47.11(B8) IC47.12(B7) IC47.13(B6) IC49.1(Q3) IC49.10(Q2) IC49.11(R2) IC49.12(S2) IC49.14(S3) IC49.15(R3) IC52.11(D:O) IC52.12(D:I0) IC52.13(D:I1) IC54.4(B:I0) IC54.5(B:I1) IC54.6(B:O) IC54.8(C:O) IC54.9(C:I0) IC54.10(C:I1) IC54.11(D:O) IC54.12(D:I0) IC54.13(D:I1) IC56.1(Q3) IC56.6(S1) IC56.7(R1) IC56.9(Q1) IC56.10(Q2) IC56.11(R2) IC56.12(S2) IC56.14(S3) IC56.15(R3) IC57.3(B:I) IC57.4(B:O) IC57.5(C:I) IC57.6(C:O) IC57.8(D:O) IC57.9(D:I) IC57.10(E:O) IC57.11(E:I) IC57.12(F:O) IC57.13(F:I) IC58.7(A6) IC58.8(A7) IC58.9(A8) IC58.11(B8) IC58.12(B7) IC58.13(B6) IC59.4(B:I0) IC59.5(B:I1) IC59.6(B:O) IC59.8(C:O) IC59.9(C:I0) IC59.10(C:I1) IC59.11(D:O) IC59.12(D:I0) IC59.13(D:I1) IC60.14(6D) IC60.15(6Q) IC60.16(7Q) IC60.17(7D) IC60.18(8D) IC60.19(8Q) IC62.4(B:I0) IC62.5(B:I1) IC62.6(B:O) IC62.8(C:O) IC62.9(C:I0) IC62.10(C:I1) IC62.11(D:O) IC62.12(D:I0) IC62.13(D:I1) IC65.14(6D) IC65.15(6Q) IC65.16(7Q) IC65.17(7D) IC65.18(8D) IC65.19(8Q) IC67.6(Q3) IC67.11(D3) IC68.10(E:O) IC68.11(E:I) IC68.12(F:O) IC68.13(F:I) V1.13(!BO) V2.13(!BO) V3.7(QD) V3.9(D) V3.12(!CO) V3.13(!BO)

## Notes on the sheet
- Acc
- X=15 (Underflow)
- ACC Latch
- X=10 (overflow)
- X Register | Acc Output
- X | PC
- Y | Flags
- operand register | Y Register | X=Y
- clock | X<Y
- S1
- Function | X>Y
- S2 | S3 | Flag Output
- D0 Underflow
- D1 Overflow
- D2 X=Y
- D3 X<Y
- D4 X>Y
- Address
- ROM 1 | ROM 2 | ROM 3 | ROM 4 | ROM 5
- IO
- full reset

## Power pins joined to a net without a drawn wire
+UB: V1.16(+UB) V2.16(+UB) V3.16(+UB)
-UB: V1.8(-UB) V2.8(-UB) V3.8(-UB)
GND: IC3.7(P:GND) IC4.7(P:GND) IC5.7(P:GND) IC8.7(P:GND) IC9.7(P:GND) IC10.7(P:GND) IC16.7(P:GND) IC17.7(P:GND) IC18.7(P:GND) IC19.7(P:GND) IC20.7(P:GND) IC21.7(P:GND) IC22.7(P:GND) IC23.7(P:GND) IC24.7(P:GND) IC26.7(P:GND) IC28.10(GND) IC29.10(GND) IC30.7(P:GND) IC31.7(P:GND) IC32.10(GND) IC33.10(GND) IC35.10(GND) IC36.10(GND) IC37.10(GND) IC39.7(P:GND) IC40.7(P:GND) IC41.12(GND) IC44.7(P:GND) IC45.7(P:GND) IC46.7(P:GND) IC47.10(GND) IC51.7(P:GND) IC52.7(P:GND) IC53.7(P:GND) IC54.7(P:GND) IC55.7(P:GND) IC57.7(P:GND) IC58.10(GND) IC59.7(P:GND) IC60.10(GND) IC62.7(P:GND) IC65.10(GND) IC66.10(GND) IC68.7(P:GND)
VCC: IC3.14(P:VCC) IC4.14(P:VCC) IC5.14(P:VCC) IC8.14(P:VCC) IC9.14(P:VCC) IC10.14(P:VCC) IC16.14(P:VCC) IC17.14(P:VCC) IC18.14(P:VCC) IC19.14(P:VCC) IC20.14(P:VCC) IC21.14(P:VCC) IC22.14(P:VCC) IC23.14(P:VCC) IC24.14(P:VCC) IC26.14(P:VCC) IC28.20(VCC) IC29.20(VCC) IC30.14(P:VCC) IC31.14(P:VCC) IC32.20(VCC) IC33.20(VCC) IC35.20(VCC) IC36.20(VCC) IC37.20(VCC) IC39.14(P:VCC) IC40.14(P:VCC) IC41.24(VCC) IC44.14(P:VCC) IC45.14(P:VCC) IC46.14(P:VCC) IC47.20(VCC) IC51.14(P:VCC) IC52.14(P:VCC) IC53.14(P:VCC) IC54.14(P:VCC) IC55.14(P:VCC) IC57.14(P:VCC) IC58.20(VCC) IC59.14(P:VCC) IC60.20(VCC) IC62.14(P:VCC) IC65.20(VCC) IC66.20(VCC) IC68.14(P:VCC)
VDD: IC1.16(VDD) IC2.16(VDD) IC6.16(VDD) IC7.16(VDD) IC25.16(VDD) IC27.16(VDD) IC34.16(VDD) IC38.16(VDD) IC42.16(VDD) IC43.16(VDD) IC48.16(VDD) IC49.16(VDD) IC50.16(VDD) IC56.16(VDD) IC61.16(VDD) IC63.16(VDD) IC64.16(VDD) IC67.16(VDD)
VSS: IC1.8(VSS) IC2.8(VSS) IC6.8(VSS) IC7.8(VSS) IC25.8(VSS) IC27.8(VSS) IC34.8(VSS) IC38.8(VSS) IC42.8(VSS) IC43.8(VSS) IC48.8(VSS) IC49.8(VSS) IC50.8(VSS) IC56.8(VSS) IC61.8(VSS) IC63.8(VSS) IC64.8(VSS) IC67.8(VSS)

## Library data of the parts
IC1 IC7 = 40xx:4017: COUNTER/DIVIDER
IC2 IC27 IC34 IC48 IC49 IC56 IC61 = 40xx:4043: Quad 3-state NOR R/S LATCH
IC3 IC8 IC26 IC40 IC44 IC45 IC55 IC59 IC62 = 74xx-us:74*32: Quad 2-input OR gate
IC4 IC16-IC24 IC51-IC54 = 74xx-us:74*08: Quad 2-input AND gate
IC5 IC10 IC31 IC39 IC46 IC57 IC68 = 74xx-us:74*04: Hex INVERTER
IC6 = 40xx:4040: 12-stage binary/ripple COUNTER
IC9 = 74xx-us:74*74: Dual D type positive edge triggered FLIP FLOP, preset and clear
IC11-IC15 = microchip:28*16A: CMOS EPROM 16 K (2 K x 8) Source: ww1.microchip.com/downloads/en/DeviceDoc/11125J.pdf; MPN: CAT28C16ALI-12; OC_FARNELL: 1718292; OC_NEWARK: 06R0648
IC25 IC38 IC50 IC63 IC64 IC67 = 40xx:4076: Quad D-type REGISTER
IC28 IC29 IC37 IC60 IC65 IC66 = 74xx-us:74*374: Octal D type transparent LATCH, edge triggered
IC30 = 74xx-us:74*126: Quad bus BUFFER, 3-state
IC32 IC33 IC35 IC36 IC47 IC58 = 74xx-us:74*245: Octal BUS TRANSCEIVER, 3-state
IC41 = 74xx-us:74*181: ARITHMETIC LOGIC UNIT function generator
IC42 IC43 = 40xx:4042: Quad clocked D LATCH
JP1 = pinhead:PINHD-1X3: PIN HEADER
JP2 = pinhead:PINHD-1X18: PIN HEADER
JP3 = pinhead:PINHD-1X11: PIN HEADER
V1-V3 = 74ttl-din:74*193: Synchronus 4-bit up down COUNTER